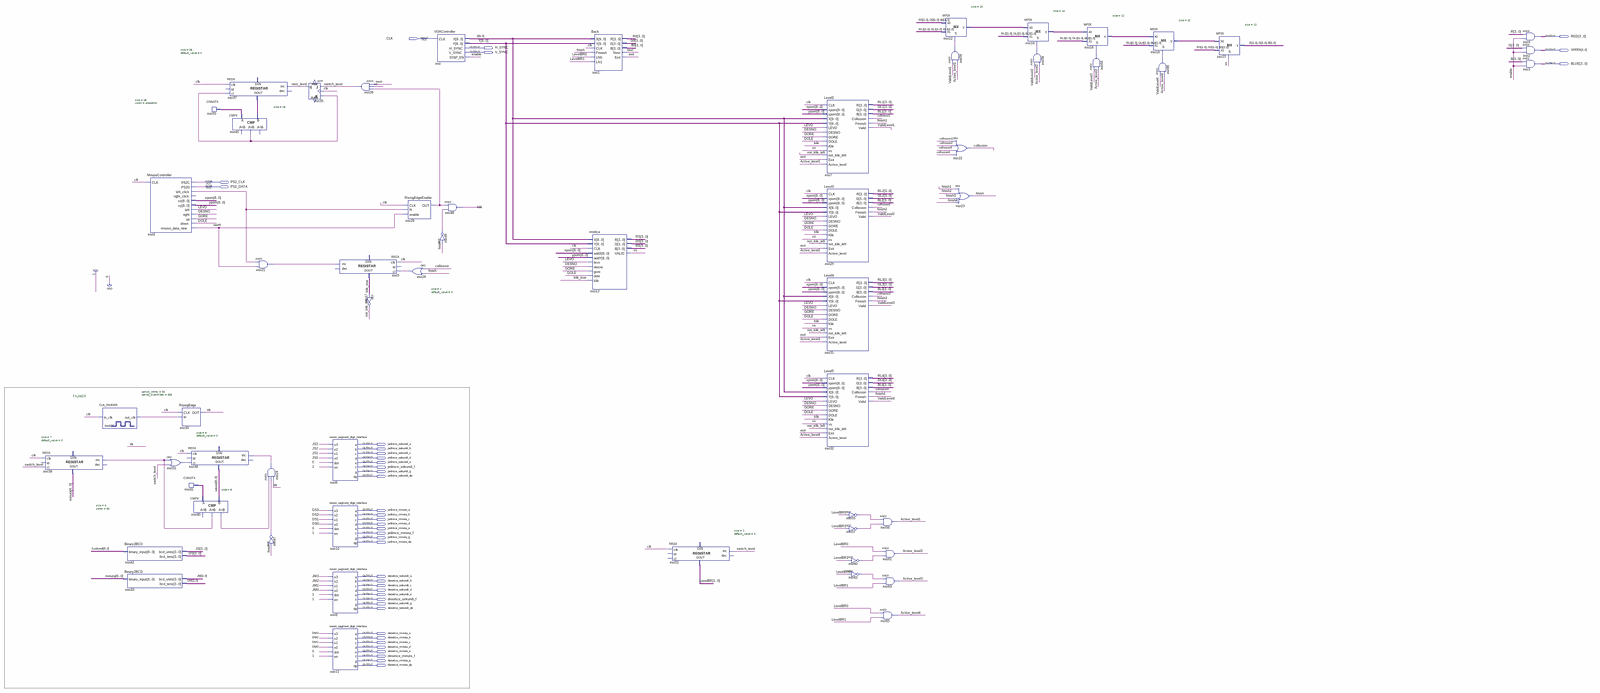
[diagram p0: schematic sheet, whole]
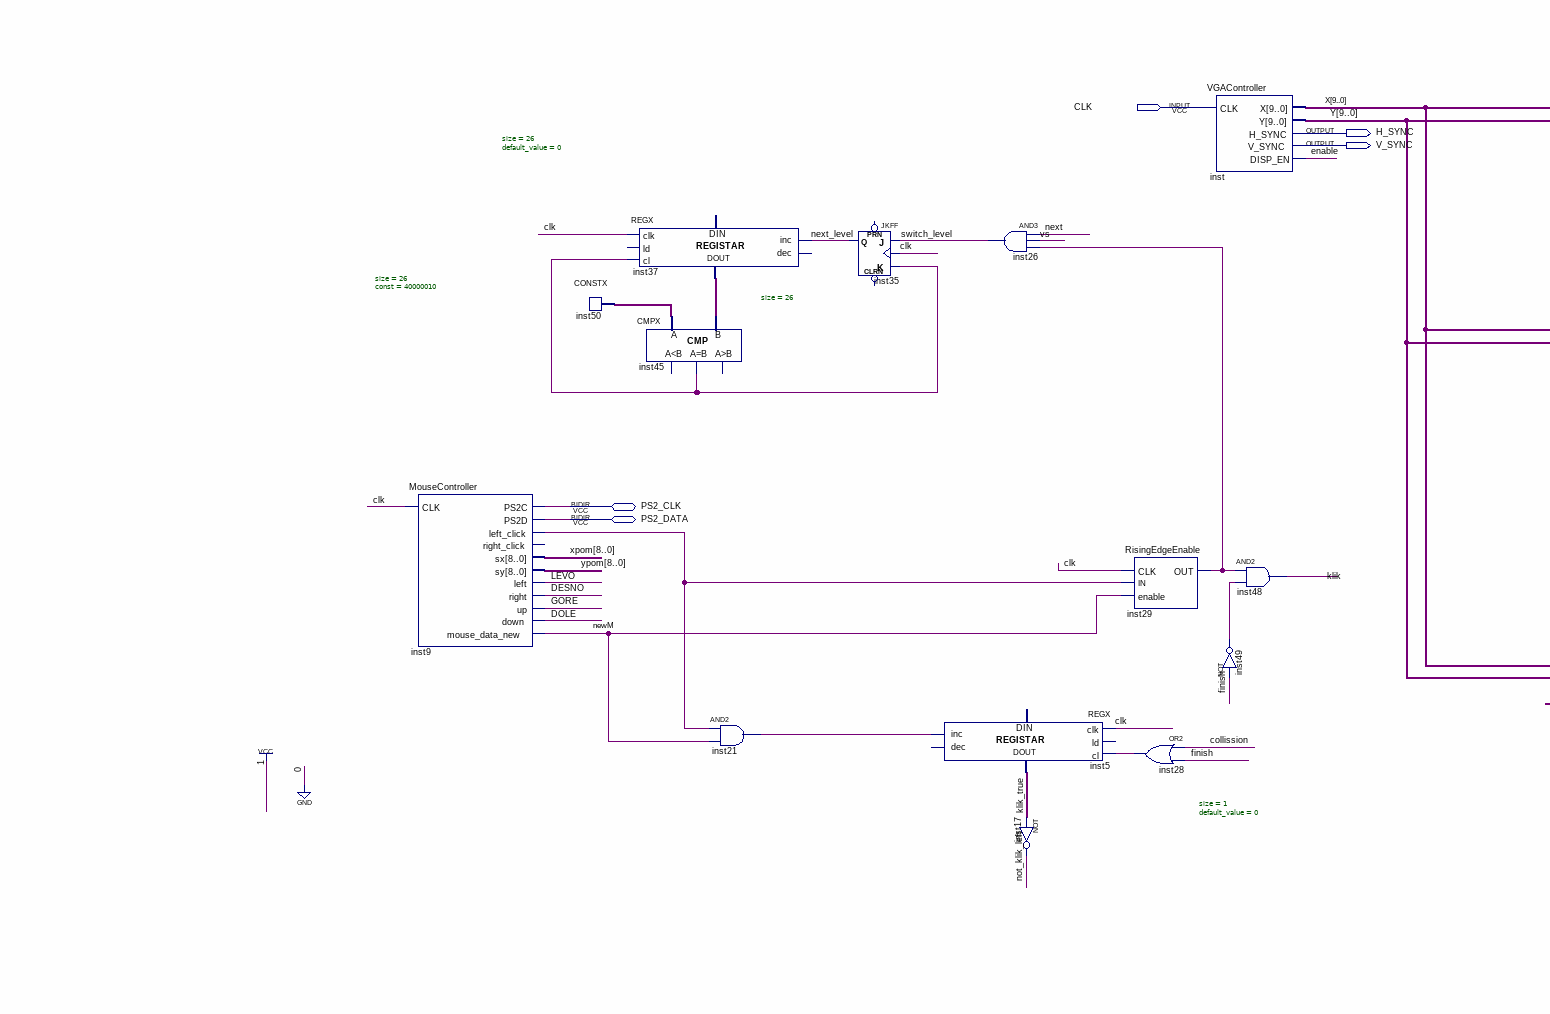
[diagram p1: schematic sheet, upper left part]
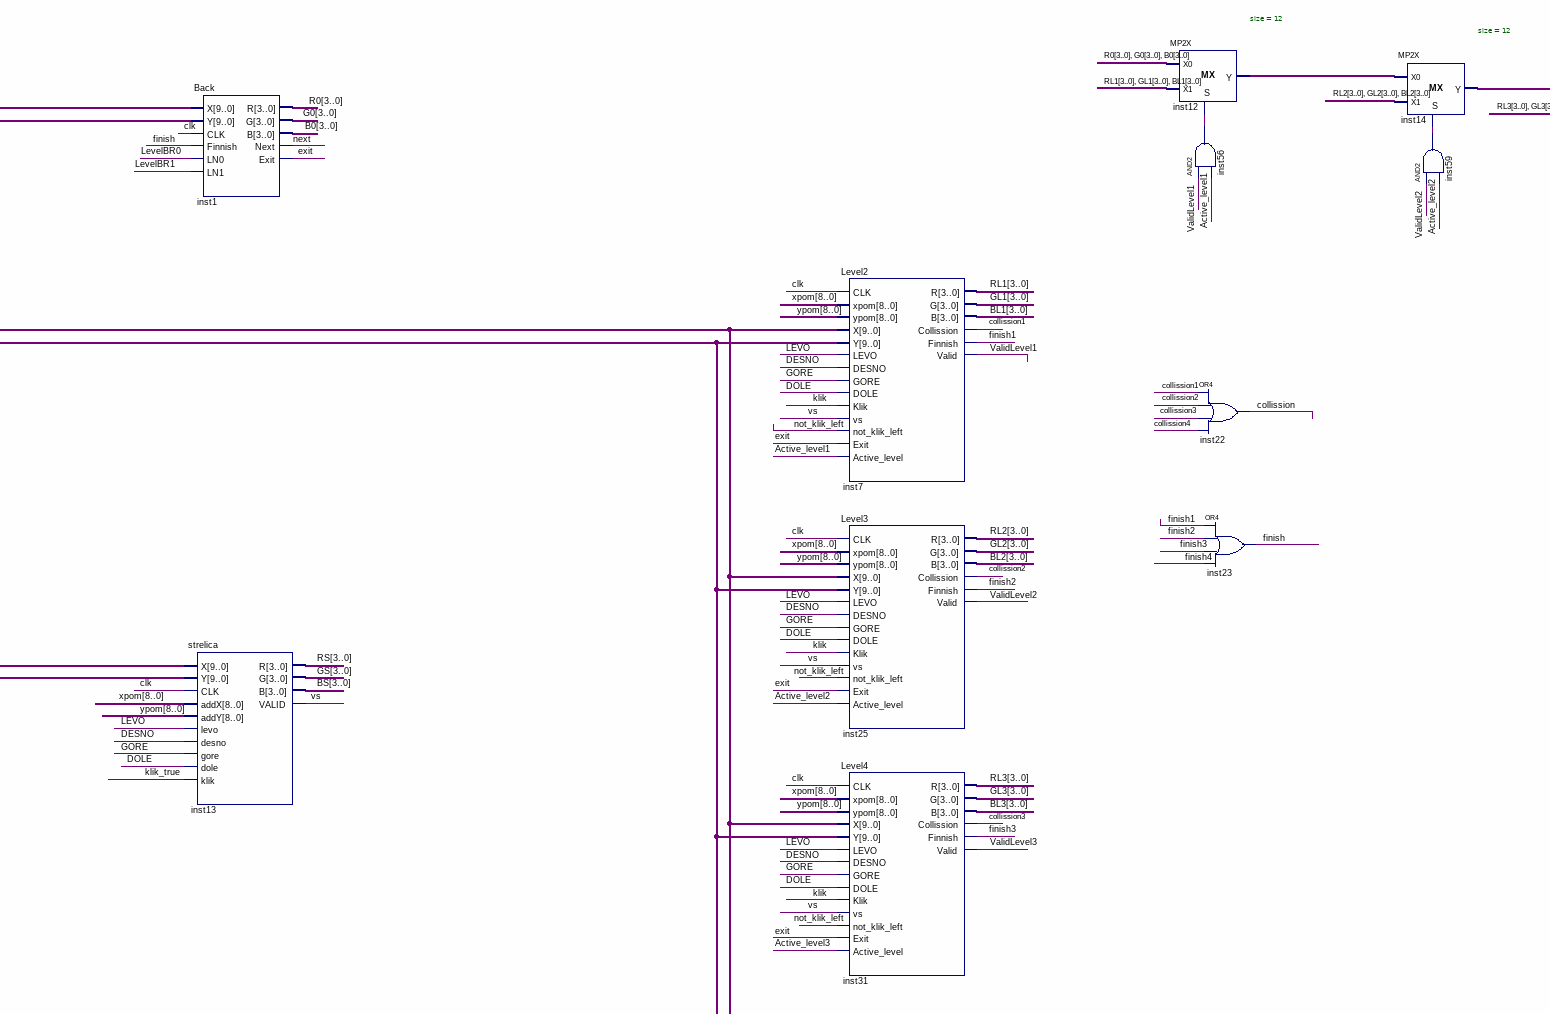
[diagram p2: schematic sheet, upper centre part]
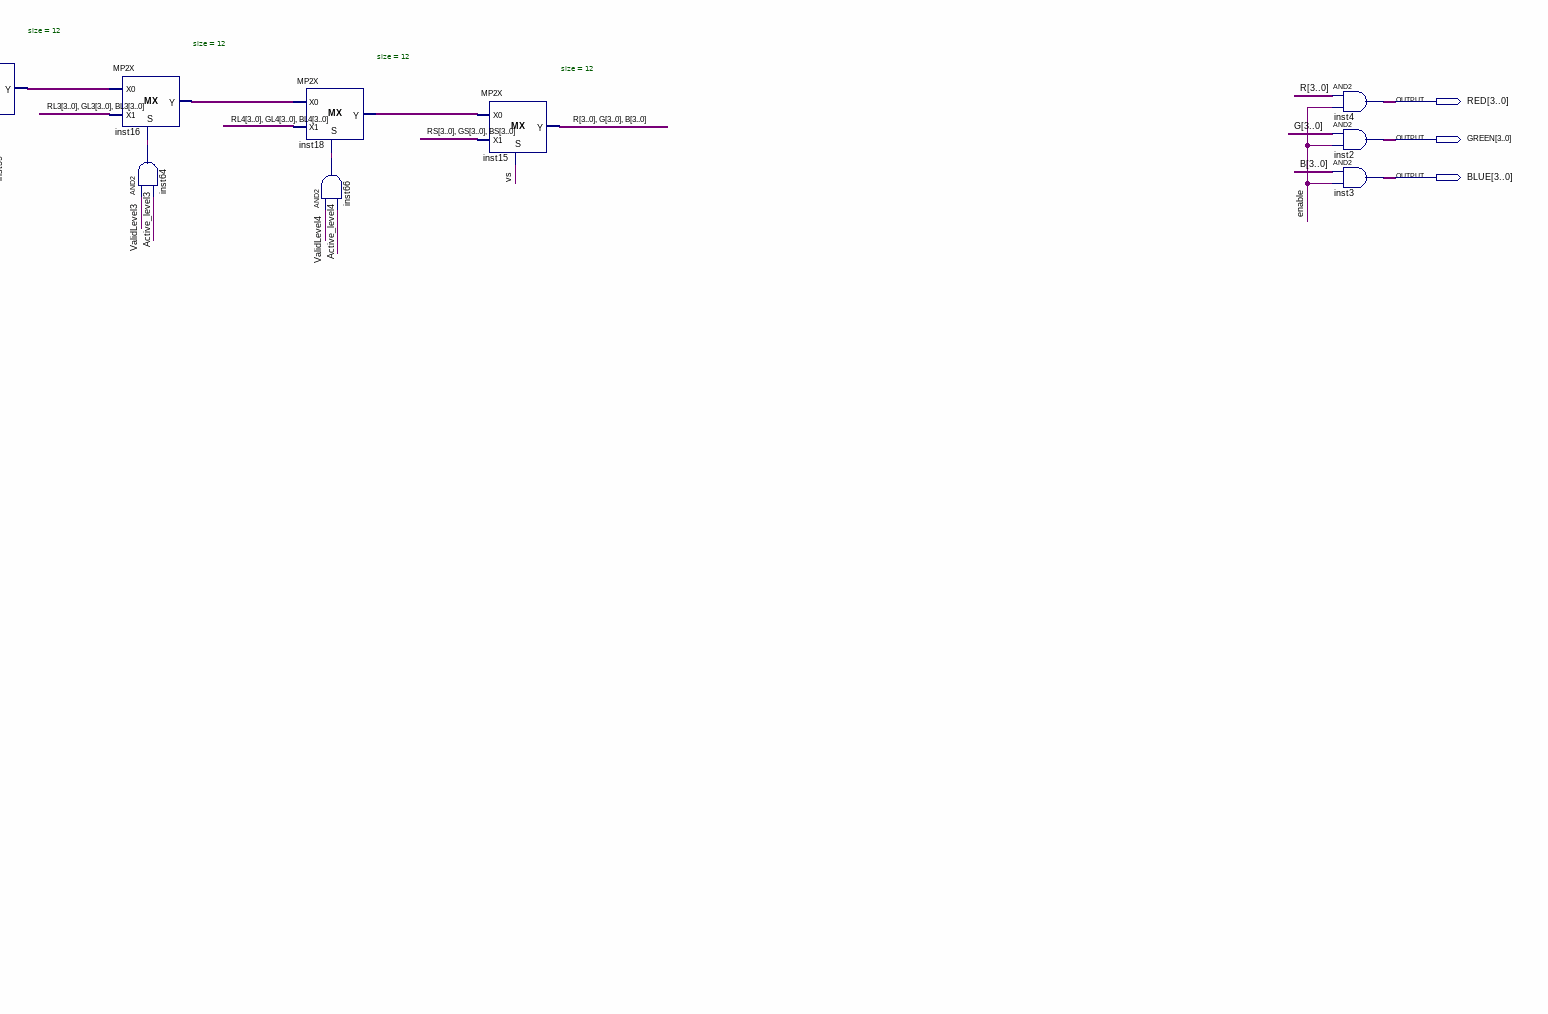
[diagram p3: schematic sheet, upper right part]
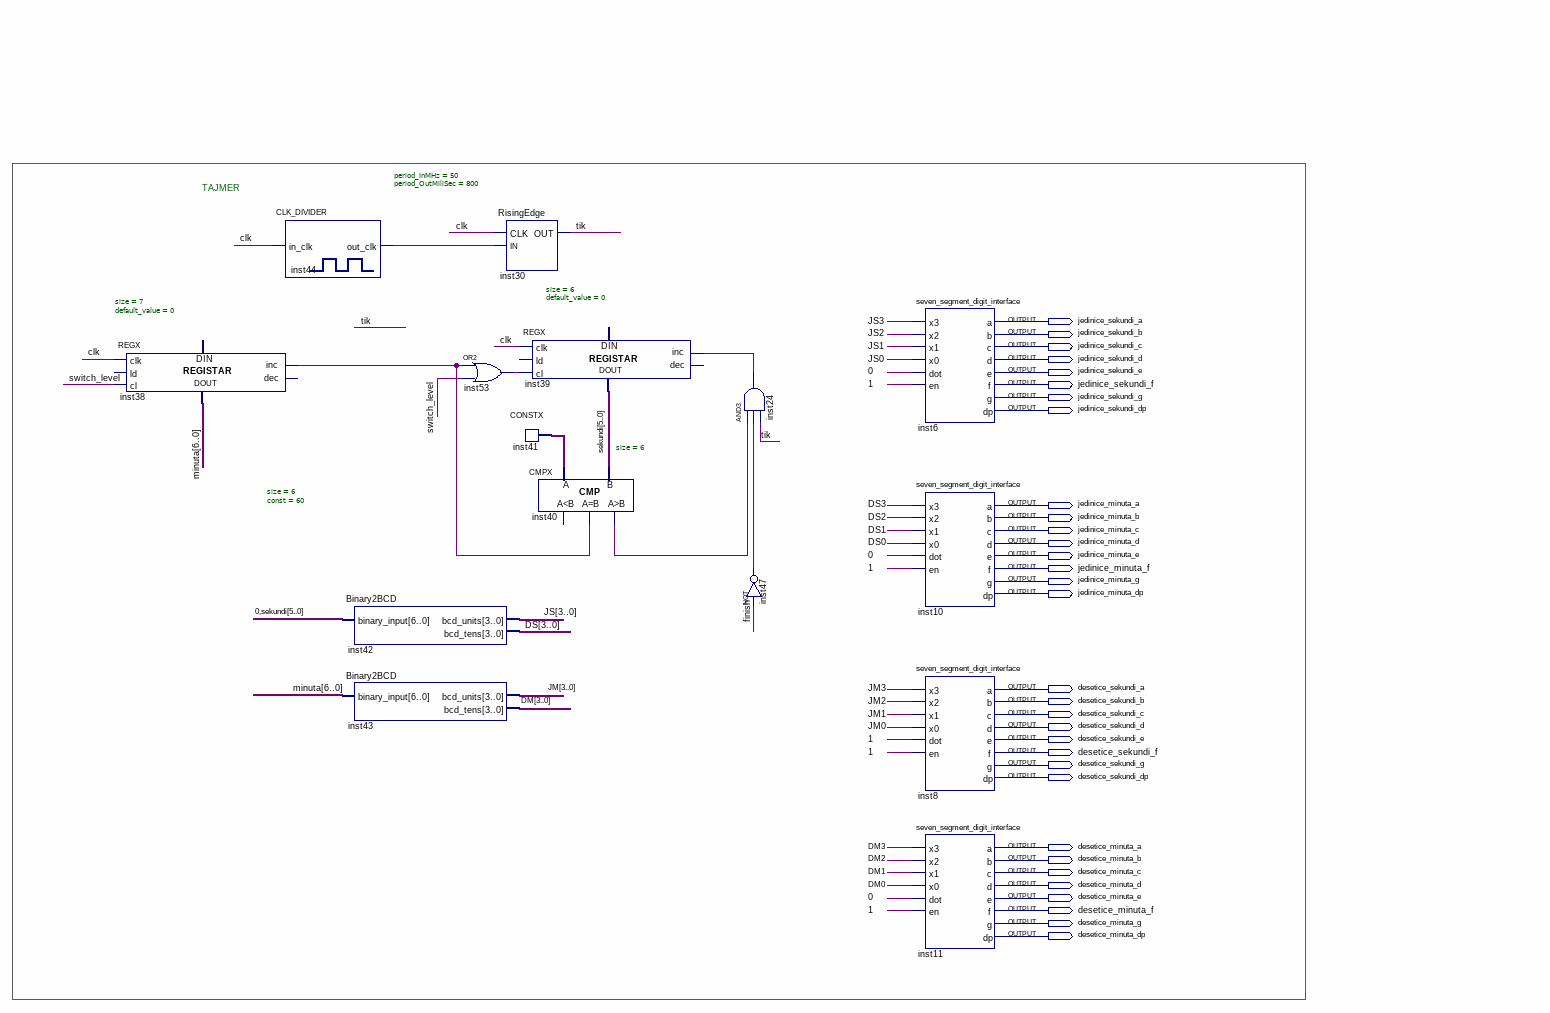
[diagram p4: schematic sheet, lower left part]
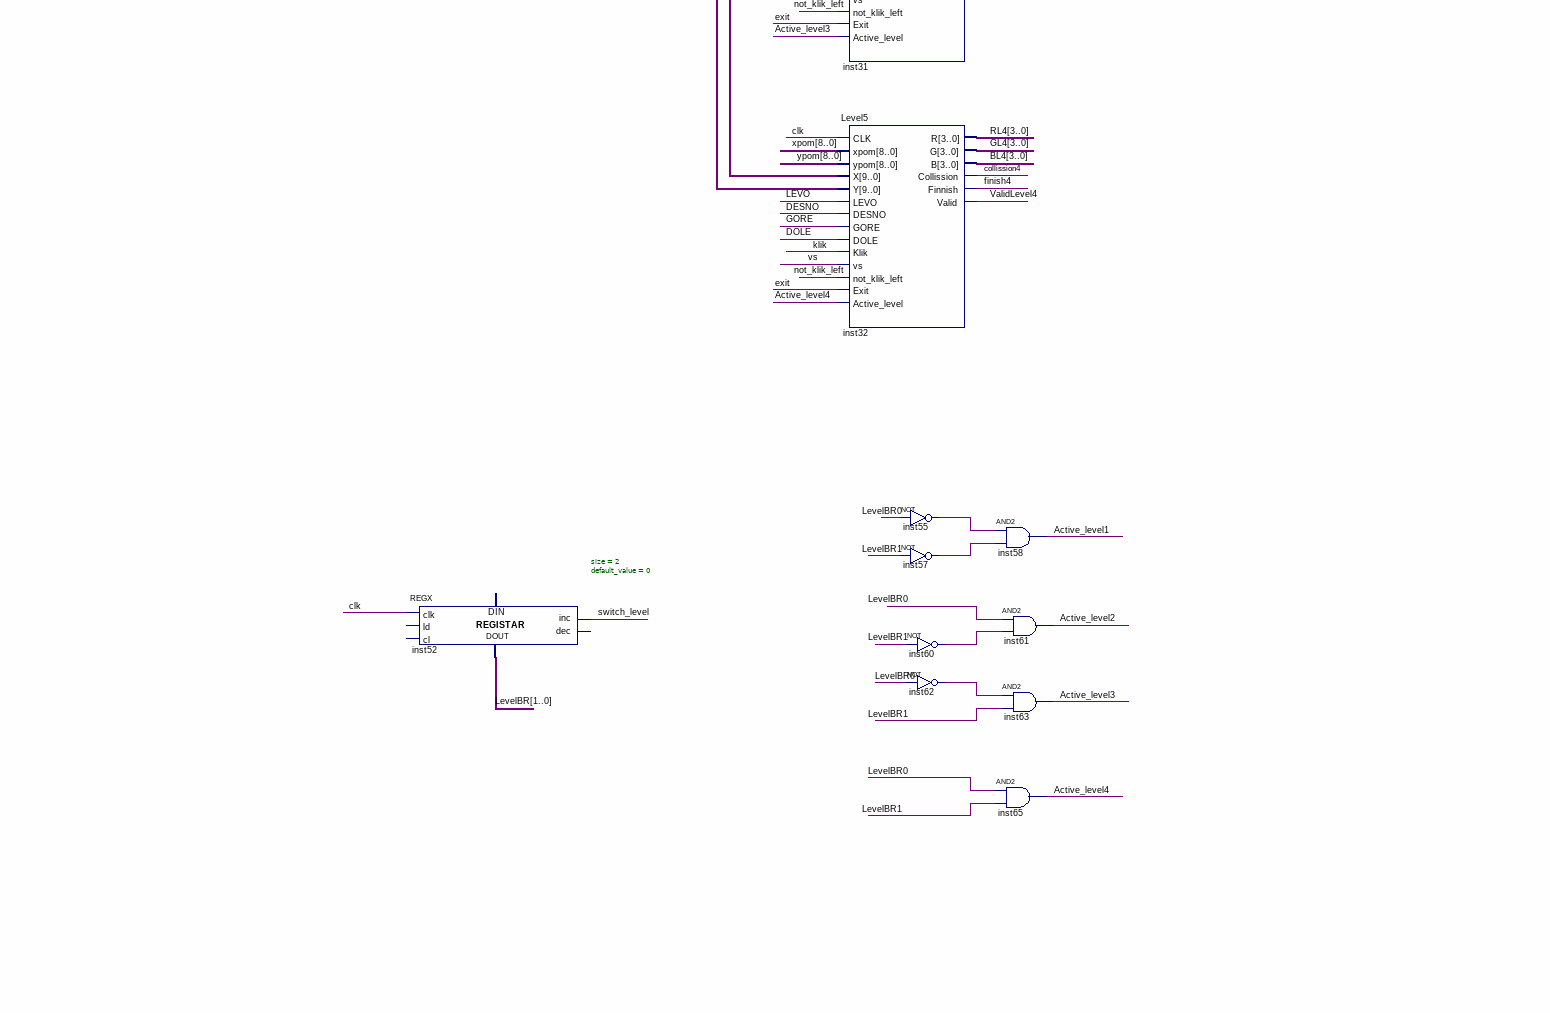
[diagram p5: schematic sheet, lower centre part]
// Quartus schematic grafika.bdf as structural Verilog: 58 symbols, 40 pins
module grafika (
  input  CLK,
  inout  PS2_CLK,
  inout  PS2_DATA,
  output [3:0] RED,
  output H_SYNC,
  output [3:0] GREEN,
  output V_SYNC,
  output [3:0] BLUE,
  output jedinice_sekundi_a,
  output jedinice_sekundi_b,
  output jedinice_sekundi_c,
  output jedinice_sekundi_d,
  output jedinice_sekundi_e,
  output jedinice_sekundi_f,
  output jedinice_sekundi_g,
  output jedinice_sekundi_dp,
  output jedinice_minuta_a,
  output jedinice_minuta_b,
  output jedinice_minuta_c,
  output jedinice_minuta_d,
  output jedinice_minuta_e,
  output jedinice_minuta_f,
  output jedinice_minuta_g,
  output jedinice_minuta_dp,
  output desetice_sekundi_a,
  output desetice_sekundi_b,
  output desetice_sekundi_c,
  output desetice_sekundi_d,
  output desetice_sekundi_e,
  output desetice_sekundi_f,
  output desetice_sekundi_g,
  output desetice_sekundi_dp,
  output desetice_minuta_a,
  output desetice_minuta_b,
  output desetice_minuta_c,
  output desetice_minuta_d,
  output desetice_minuta_e,
  output desetice_minuta_f,
  output desetice_minuta_g,
  output desetice_minuta_dp
);

  wire Active_level1, Active_level2, Active_level3, Active_level4, collission, collission1, collission2,
       collission3, collission4, DESNO, DOLE, enable, exit, finish, finish1, finish2, finish3, finish4, GORE,
       inst9_left_click, inst21_out, inst24_out, inst28_out, inst29_out, inst40_eq, inst40_gr,
       inst44_out_clk, inst45_eq, inst47_out, inst49_out, inst53_out, inst55_out, inst56_out, inst57_out,
       inst59_out, inst60_out, inst62_out, inst64_out, inst66_out, klik, klik_true, LEVO, newM, next,
       next_level, not_klik_left, switch_level, tik, ValidLevel1, ValidLevel2, ValidLevel3, ValidLevel4, vs;
  wire [1:0] LevelBR;
  wire [3:0] B, B0, BL1, BL2, BL3, BL4, BS, DM, DS, G, G0, GL1, GL2, GL3, GL4, GS, JM, JS, R, R0, RL1, RL2,
       RL3, RL4, RS;
  wire [5:0] inst41_data, sekundi;
  wire [6:0] minuta;
  wire [8:0] xpom, ypom;
  wire [9:0] X, Y;
  wire [11:0] inst12_y, inst14_y, inst16_y, inst18_y;
  wire [25:0] inst37_data_out, inst50_data;

  REGX #(.size(7), .default_value(0)) inst38 (
    .clk(CLK), .cl(switch_level), .inc(inst40_eq), .data_out(minuta));  // open: ld, dec, data_in
  CLK_DIVIDER #(.period_InMHz(50), .period_OutMiliSec(800)) inst44 (.in_clk(CLK), .out_clk(inst44_out_clk));
  Binary2BCD inst42 (.binary_input({1'b0, sekundi}), .bcd_units(JS), .bcd_tens(DS));
  Binary2BCD inst43 (.binary_input(minuta), .bcd_units(JM), .bcd_tens(DM));
  MouseController inst9 (
    .CLK(CLK), .left_click(inst9_left_click), .sx(xpom), .sy(ypom), .left(LEVO), .right(DESNO), .up(GORE),
    .down(DOLE), .mouse_data_new(newM), .PS2C(PS2_CLK), .PS2D(PS2_DATA));  // open: right_click
  RisingEdge inst30 (.CLK(CLK), .IN(inst44_out_clk), .OUT(tik));
  or inst53 (inst53_out, inst40_eq, switch_level);
  REGX #(.size(6), .default_value(0)) inst39 (
    .clk(CLK), .cl(inst53_out), .inc(inst24_out), .data_out(sekundi));  // open: ld, dec, data_in
  CONSTX #(.size(6), .\const (60)) inst41 (.data(inst41_data));
  CMPX #(.size(6)) inst40 (.A(inst41_data), .B(sekundi), .eq(inst40_eq), .gr(inst40_gr));  // open: ls
  CONSTX #(.size(26), .\const (40000010)) inst50 (.data(inst50_data));
  REGX #(.size(26), .default_value(0)) inst37 (
    .clk(CLK), .cl(inst45_eq), .inc(next_level), .data_out(inst37_data_out));  // open: ld, dec, data_in
  CMPX #(.size(26)) inst45 (.A(inst50_data), .B(inst37_data_out), .eq(inst45_eq));  // open: ls, gr
  and inst21 (inst21_out, inst9_left_click, newM);
  and inst24 (inst24_out, inst40_gr, inst47_out, tik);
  not inst47 (inst47_out, finish);
  JKFF inst35 (.K(inst45_eq), .J(switch_level), .CLK(CLK), .Q(next_level));  // open: PRN, CLRN
  REGX #(.size(1), .default_value(0)) inst5 (
    .clk(CLK), .cl(inst28_out), .inc(inst21_out), .data_out(klik_true));  // open: ld, dec, data_in
  seven_segment_digit_interface inst6 (
    .x3(JS[3]), .x2(JS[2]), .x1(JS[1]), .x0(JS[0]), .dot(1'b0), .en(1'b1), .a(jedinice_sekundi_a),
    .b(jedinice_sekundi_b), .c(jedinice_sekundi_c), .d(jedinice_sekundi_d), .e(jedinice_sekundi_e),
    .f(jedinice_sekundi_f), .g(jedinice_sekundi_g), .dp(jedinice_sekundi_dp));
  seven_segment_digit_interface inst10 (
    .x3(DS[3]), .x2(DS[2]), .x1(DS[1]), .x0(DS[0]), .dot(1'b0), .en(1'b1), .a(jedinice_minuta_a),
    .b(jedinice_minuta_b), .c(jedinice_minuta_c), .d(jedinice_minuta_d), .e(jedinice_minuta_e),
    .f(jedinice_minuta_f), .g(jedinice_minuta_g), .dp(jedinice_minuta_dp));
  seven_segment_digit_interface inst8 (
    .x3(JM[3]), .x2(JM[2]), .x1(JM[1]), .x0(JM[0]), .dot(1'b1), .en(1'b1), .a(desetice_sekundi_a),
    .b(desetice_sekundi_b), .c(desetice_sekundi_c), .d(desetice_sekundi_d), .e(desetice_sekundi_e),
    .f(desetice_sekundi_f), .g(desetice_sekundi_g), .dp(desetice_sekundi_dp));
  seven_segment_digit_interface inst11 (
    .x3(DM[3]), .x2(DM[2]), .x1(DM[1]), .x0(DM[0]), .dot(1'b0), .en(1'b1), .a(desetice_minuta_a),
    .b(desetice_minuta_b), .c(desetice_minuta_c), .d(desetice_minuta_d), .e(desetice_minuta_e),
    .f(desetice_minuta_f), .g(desetice_minuta_g), .dp(desetice_minuta_dp));
  and inst26 (switch_level, next, vs, inst29_out);
  not inst17 (not_klik_left, klik_true);
  RisingEdgeEnable inst29 (.CLK(CLK), .IN(inst9_left_click), .enable(newM), .OUT(inst29_out));
  or inst28 (inst28_out, collission, finish);
  VGAController inst (.CLK(CLK), .X(X), .Y(Y), .H_SYNC(H_SYNC), .V_SYNC(V_SYNC), .DISP_EN(enable));
  and inst48 (klik, inst29_out, inst49_out);
  not inst49 (inst49_out, finish);
  Back inst1 (
    .X(X), .Y(Y), .CLK(CLK), .Finnish(finish), .LN0(LevelBR[0]), .LN1(LevelBR[1]), .R(R0), .G(G0), .B(B0),
    .Next(next), .Exit(exit));
  strelica inst13 (
    .X(X), .Y(Y), .CLK(CLK), .addX(xpom), .addY(ypom), .levo(LEVO), .desno(DESNO), .gore(GORE), .dole(DOLE),
    .klik(klik_true), .R(RS), .G(GS), .B(BS), .VALID(vs));
  REGX #(.size(2), .default_value(0)) inst52 (
    .clk(CLK), .inc(switch_level), .data_out(LevelBR));  // open: ld, cl, dec, data_in
  Level2 inst7 (
    .CLK(CLK), .xpom(xpom), .ypom(ypom), .X(X), .Y(Y), .LEVO(LEVO), .DESNO(DESNO), .GORE(GORE), .DOLE(DOLE),
    .Klik(klik), .vs(vs), .not_klik_left(not_klik_left), .Exit(exit), .Active_level(Active_level1), .R(RL1),
    .G(GL1), .B(BL1), .Collission(collission1), .Finnish(finish1), .Valid(ValidLevel1));
  Level3 inst25 (
    .CLK(CLK), .xpom(xpom), .ypom(ypom), .X(X), .Y(Y), .LEVO(LEVO), .DESNO(DESNO), .GORE(GORE), .DOLE(DOLE),
    .Klik(klik), .vs(vs), .not_klik_left(not_klik_left), .Exit(exit), .Active_level(Active_level2), .R(RL2),
    .G(GL2), .B(BL2), .Collission(collission2), .Finnish(finish2), .Valid(ValidLevel2));
  Level4 inst31 (
    .CLK(CLK), .xpom(xpom), .ypom(ypom), .X(X), .Y(Y), .LEVO(LEVO), .DESNO(DESNO), .GORE(GORE), .DOLE(DOLE),
    .Klik(klik), .vs(vs), .not_klik_left(not_klik_left), .Exit(exit), .Active_level(Active_level3), .R(RL3),
    .G(GL3), .B(BL3), .Collission(collission3), .Finnish(finish3), .Valid(ValidLevel3));
  Level5 inst32 (
    .CLK(CLK), .xpom(xpom), .ypom(ypom), .X(X), .Y(Y), .LEVO(LEVO), .DESNO(DESNO), .GORE(GORE), .DOLE(DOLE),
    .Klik(klik), .vs(vs), .not_klik_left(not_klik_left), .Exit(exit), .Active_level(Active_level4), .R(RL4),
    .G(GL4), .B(BL4), .Collission(collission4), .Finnish(finish4), .Valid(ValidLevel4));
  not inst55 (inst55_out, LevelBR[0]);
  not inst57 (inst57_out, LevelBR[1]);
  not inst60 (inst60_out, LevelBR[1]);
  not inst62 (inst62_out, LevelBR[0]);
  and inst58 (Active_level1, inst55_out, inst57_out);
  and inst61 (Active_level2, LevelBR[0], inst60_out);
  and inst63 (Active_level3, inst62_out, LevelBR[1]);
  and inst65 (Active_level4, LevelBR[0], LevelBR[1]);
  MP2X #(.size(12)) inst12 (.S(inst56_out), .X0({R0, G0, B0}), .X1({RL1, GL1, BL1}), .Y(inst12_y));
  and inst56 (inst56_out, ValidLevel1, Active_level1);
  or inst22 (collission, collission1, collission2, collission3, collission4);
  or inst23 (finish, finish1, finish2, finish3, finish4);
  MP2X #(.size(12)) inst14 (.S(inst59_out), .X0(inst12_y), .X1({RL2, GL2, BL2}), .Y(inst14_y));
  and inst59 (inst59_out, ValidLevel2, Active_level2);
  MP2X #(.size(12)) inst16 (.S(inst64_out), .X0(inst14_y), .X1({RL3, GL3, BL3}), .Y(inst16_y));
  and inst64 (inst64_out, ValidLevel3, Active_level3);
  MP2X #(.size(12)) inst18 (.S(inst66_out), .X0(inst16_y), .X1({RL4, GL4, BL4}), .Y(inst18_y));
  and inst66 (inst66_out, ValidLevel4, Active_level4);
  MP2X #(.size(12)) inst15 (.S(vs), .X0(inst18_y), .X1({RS, GS, BS}), .Y({R, G, B}));
  assign RED = R & {4{enable}};  // AND2 inst4, 4 bits wide
  assign GREEN = G & {4{enable}};  // AND2 inst2, 4 bits wide
  assign BLUE = B & {4{enable}};  // AND2 inst3, 4 bits wide

  // Notes on the sheet:
  //   TAJMER
endmodule
